# Altium schematic sheet 原理图.SchDoc
size A2
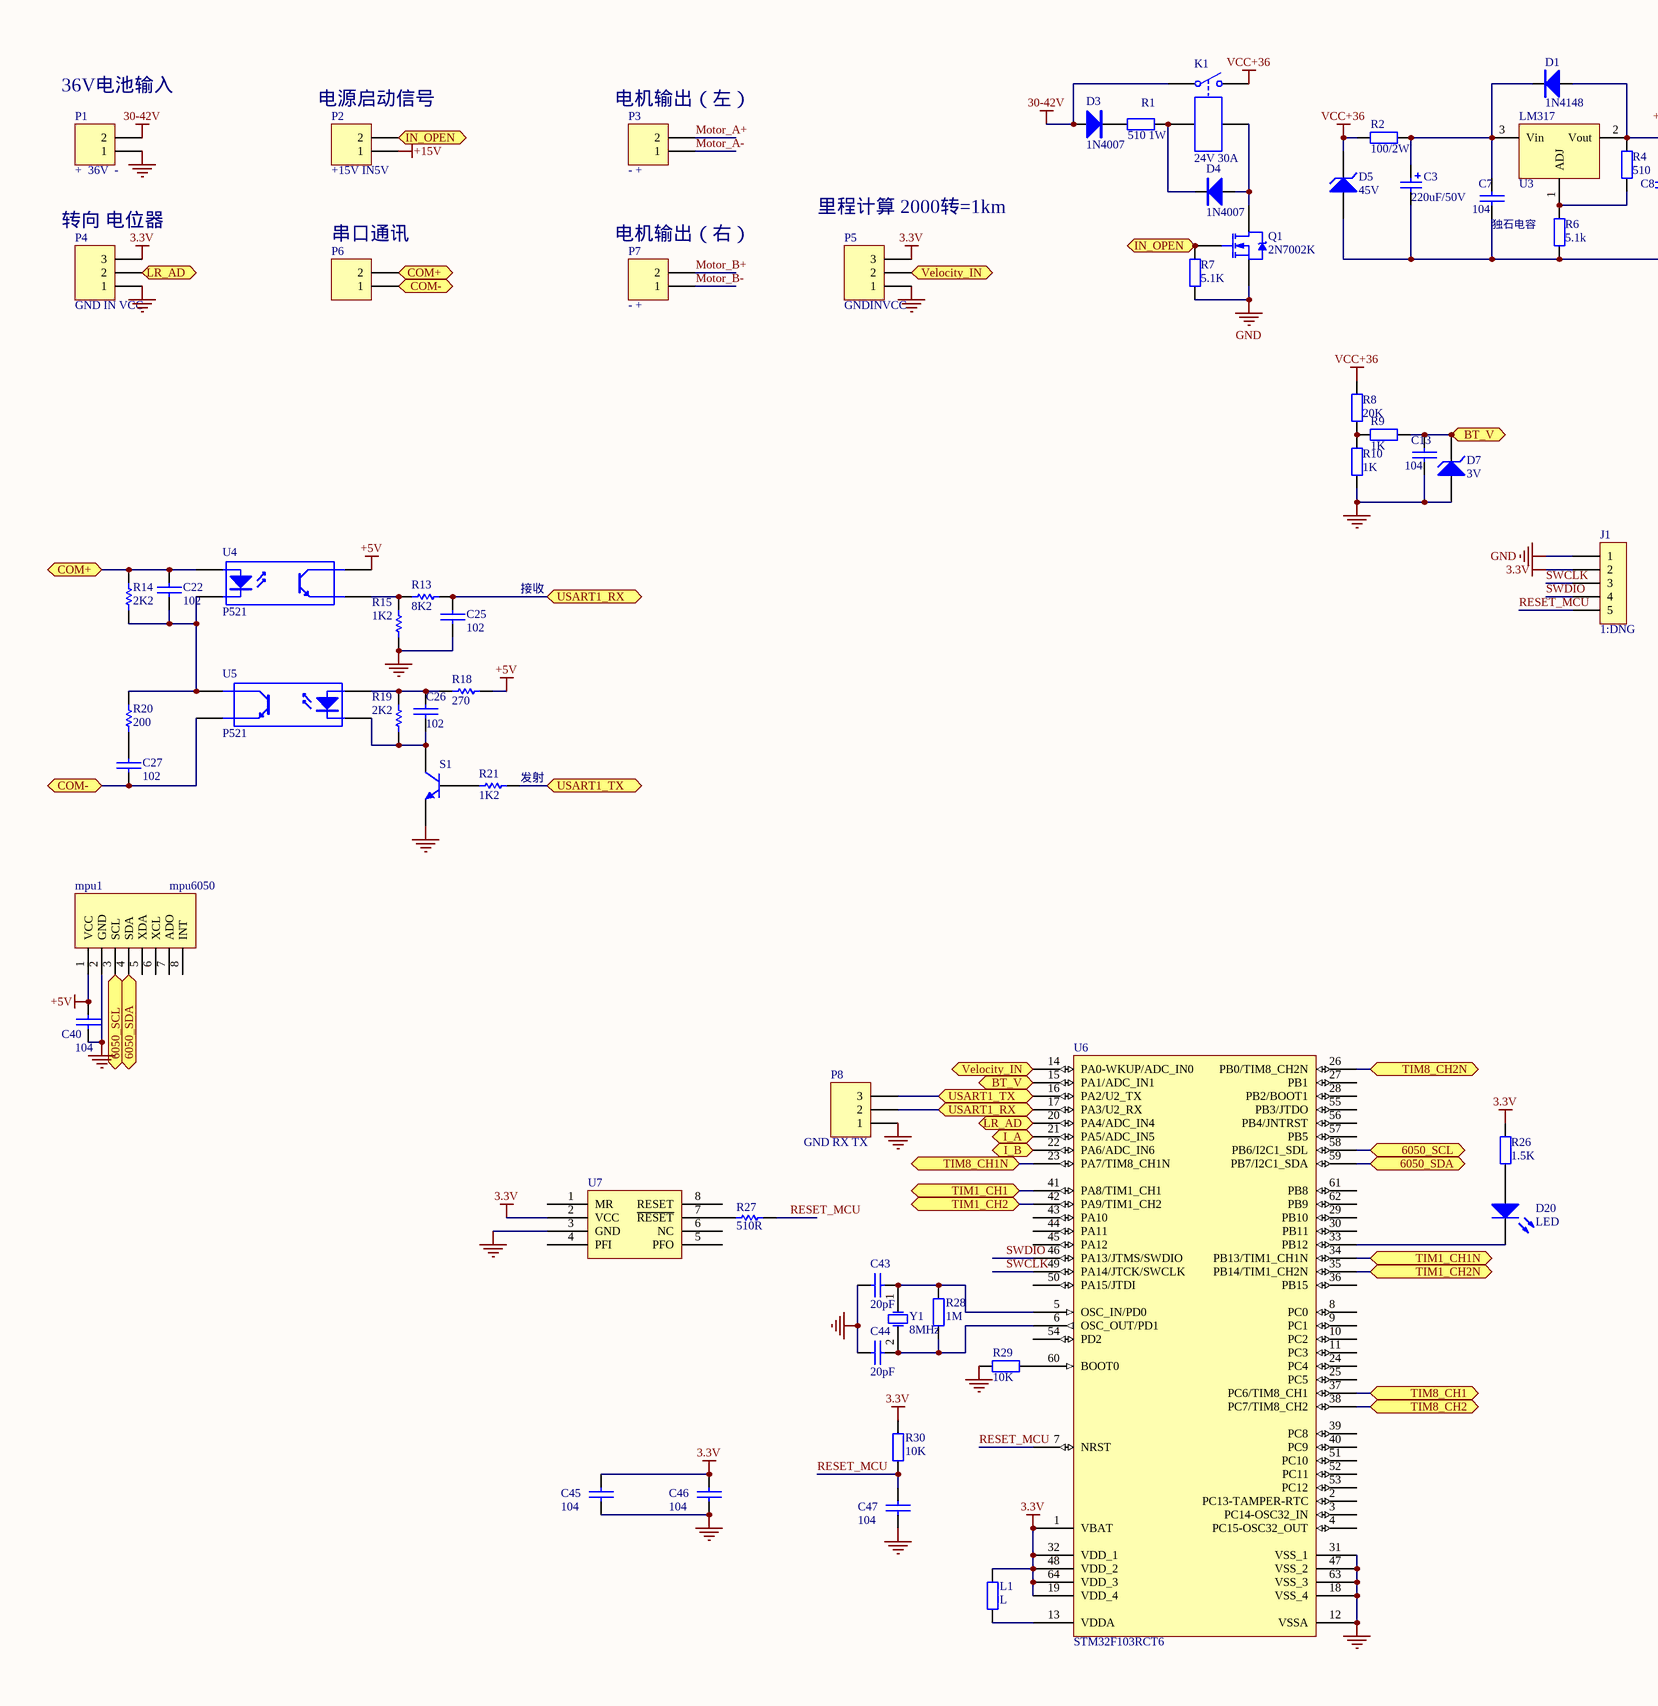
[diagram p0: 原理图.SchDoc, left]
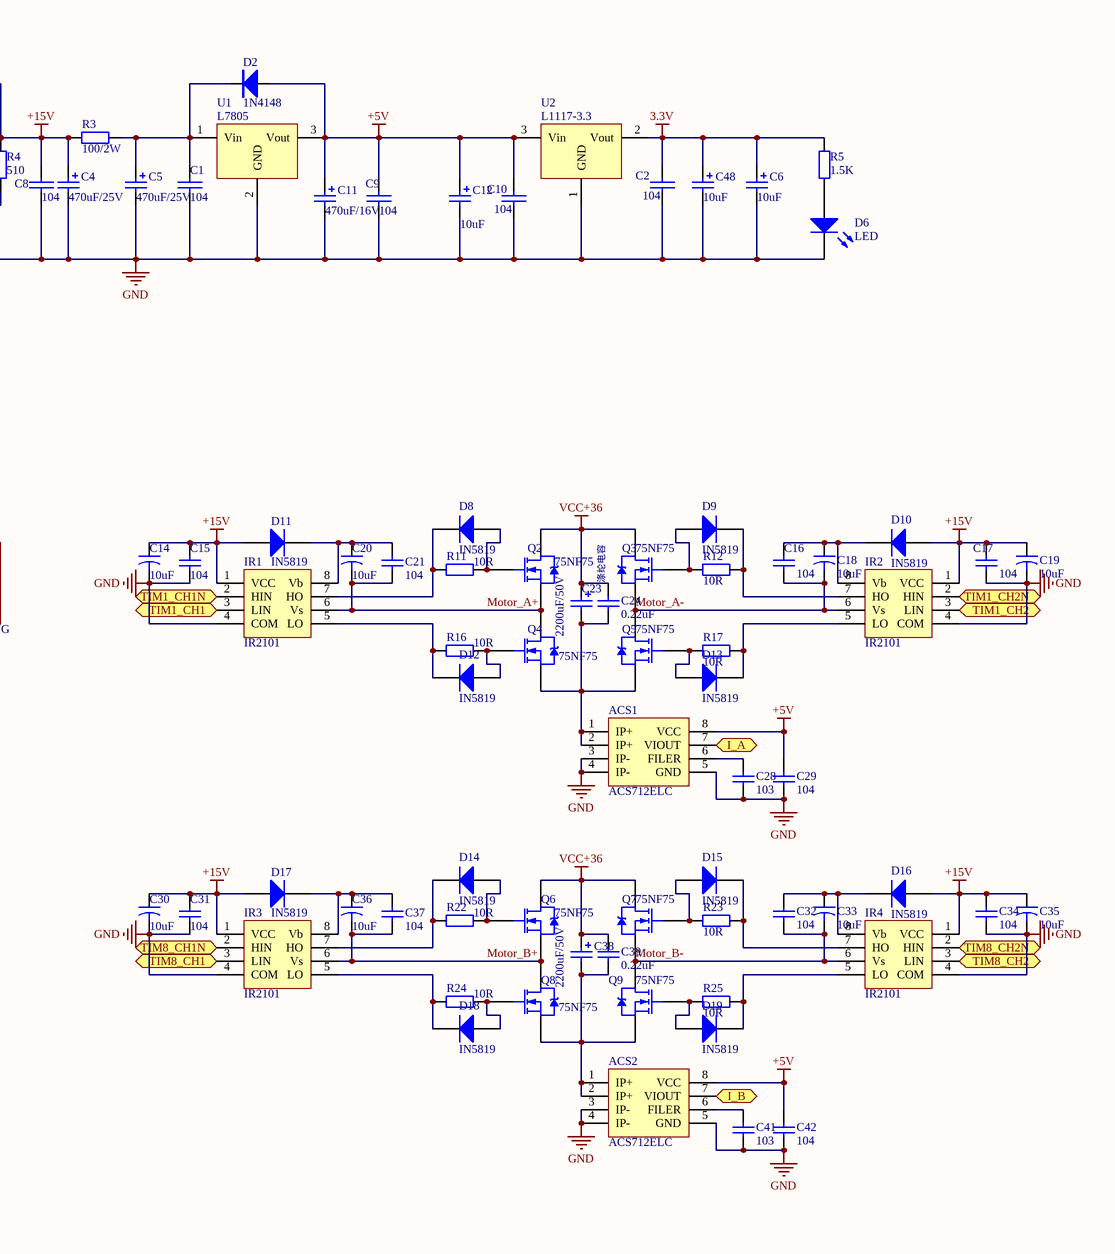
[diagram p1: 原理图.SchDoc, right]

## Parts
ACS1  ACS712ELC  [so-8]
ACS2  ACS712ELC  [so-8]
C1  104  [6-0805]
C2  104  [6-0805]
C3  220uF/50V  [SMD-EC-F10]
C4  470uF/25V  [SMD-EC-F10]
C5  470uF/25V  [SMD-EC-F10]
C6  10uF  [3216]
C7  104  [6-0805]
C8  104  [6-0805]
C9  104  [6-0805]
C10  104  [6-0805]
C11  470uF/16V  [SMD-EC-F8]
C12  10uF  [3216]
C13  104  [6-0805]
C14  10uF  [SMD-EC-F4]
C15  104  [6-0805]
C16  104  [6-0805]
C17  104  [6-0805]
C18  10uF  [SMD-EC-F4]
C19  10uF  [SMD-EC-F4]
C20  10uF  [SMD-EC-F4]
C21  104  [6-0805]
C22  102  [6-0805]
C23  2200uF/50V  [RB.3/.6]
C24  0.22uF  [RAD-0.2]
C25  102  [6-0805]
C26  102  [6-0805]
C27  102  [6-0805]
C28  103  [6-0805]
C29  104  [6-0805]
C30  10uF  [SMD-EC-F4]
C31  104  [6-0805]
C32  104  [6-0805]
C33  10uF  [SMD-EC-F4]
C34  104  [6-0805]
C35  10uF  [SMD-EC-F4]
C36  10uF  [SMD-EC-F4]
C37  104  [6-0805]
C38  2200uF/50V  [RB.3/.6]
C39  0.22uF  [RAD-0.2]
C40  104  [6-0805]
C41  103  [6-0805]
C42  104  [6-0805]
C43  20pF  [6-0805]
C44  20pF  [6-0805]
C45  104  [6-0805]
C46  104  [6-0805]
C47  104  [6-0805]
C48  10uF  [3216]
D1  1N4148  [1206D]
D2  1N4148  [1206D]
D3  1N4007  [1N4001]
D4  1N4007  [1N4001]
D5  45V  [1N5819]
D6  LED  [LEDTT]
D7  3V  [1206D]
D8  IN5819  [1N4001]
D9  IN5819  [1N4001]
D10  IN5819  [1N4001]
D11  IN5819  [1N4001]
D12  IN5819  [1N4001]
D13  IN5819  [1N4001]
D14  IN5819  [1N4001]
D15  IN5819  [1N4001]
D16  IN5819  [1N4001]
D17  IN5819  [1N4001]
D18  IN5819  [1N4001]
D19  IN5819  [1N4001]
D20  LED  [LEDTT]
IR1  IR2101  [so-8]
IR2  IR2101  [so-8]
IR3  IR2101  [so-8]
IR4  IR2101  [so-8]
J1  1:DNG  [HDR1X5H]
K1  24V 30A  [SLA]
L1  L  [0805]
mpu1  mpu6050  [MPU6050]
P1  +  36V  -  [KF1000-2P]
P2  +15V IN5V  [MKDS15_2RMI]
P3  - +  [KF1000-2P]
P4  GND IN VCC  [MKDS15_3RMI]
P5  GNDINVCC  [MKDS15_3RMI]
P6  com+ com-  [MKDS15_2RMI]  (value not drawn)
P7  - +  [KF1000-2P]
P8  GND RX TX  [HDR1X3H]
Q1  2N7002K  [SOT-23]
Q2  75NF75  [COMS-220S]
Q3  75NF75  [COMS-220S]
Q4  75NF75  [COMS-220S]
Q5  75NF75  [COMS-220S]
Q6  75NF75  [COMS-220S]
Q7  75NF75  [COMS-220S]
Q8  75NF75  [COMS-220S]
Q9  75NF75  [COMS-220S]
R1  510 1W  [r]
R2  100/2W  [R]
R3  100/2W  [R]
R4  510  [0805]
R5  1.5K  [0805]
R6  5.1k  [0805]
R7  5.1K  [0805]
R8  20K  [0805]
R9  1K  [0805]
R10  1K  [0805]
R11  10R  [0805]
R12  10R  [0805]
R13  8K2  [0805]
R14  2K2  [0805]
R15  1K2  [0805]
R16  10R  [0805]
R17  10R  [0805]
R18  270  [0805]
R19  2K2  [0805]
R20  200  [0805]
R21  1K2  [0805]
R22  10R  [0805]
R23  10R  [0805]
R24  10R  [0805]
R25  10R  [0805]
R26  1.5K  [0805]
R27  510R  [0805]
R28  1M  [0805]
R29  10K  [0805]
R30  10K  [0805]
S1  8050  [SOT23A]  (value not drawn)
U1  L7805  [D2PAK]
U2  L1117-3.3  [SOT223]
U3  LM317  [D2PAK]
U4  P521  [SO-4]
U5  P521  [SO-4]
U6  STM32F103RCT6  [LQFP64_N]
U7  MAX708-3.3  [SMD8A]  (value not drawn)
Y1  8MHz  [XTAL]

## Ports
6050_SCL, 6050_SDA, BT_V, COM+, COM-, I_A, I_B, IN_OPEN, LR_AD, TIM1_CH1, TIM1_CH1N, TIM1_CH2, TIM1_CH2N, TIM8_CH1, TIM8_CH1N, TIM8_CH2, TIM8_CH2N, USART1_RX, USART1_TX, Velocity_IN

## Nets
3.3V: C2.1 C6.1 C45.2 C46.2 C48.1 J1.2 L1.2 P4.3 P5.3 R5.2 R26.2 R30.2 U2.2(Vout) U6.1(VBAT) U6.19(VDD_4) U6.32(VDD_1) U6.48(VDD_2) U6.64(VDD_3) U7.2(VCC)
30-42V: D3.1 K1.1 P1.2
+5V: ACS1.8(VCC) ACS2.8(VCC) C9.1 C10.1 C11.1 C12.1 C29.2 C40.1 C42.2 D2.1 mpu1.1(VCC) R18.1 U1.3(Vout) U2.3(Vin) U4.4(C)
+15V: C4.1 C8.1 C14.1 C15.1 C17.1 C19.1 C30.1 C31.1 C34.1 C35.1 D1.1 D10.1(A) D11.1(A) D16.1(A) D17.1(A) IR1.1(VCC) IR2.1(VCC) IR3.1(VCC) IR4.1(VCC) P2.1 R3.1 R4.1 U3.2(Vout)
GND: ACS1.3(IP-) ACS1.4(IP-) ACS1.5(GND) ACS2.3(IP-) ACS2.4(IP-) ACS2.5(GND) C1.2 C2.2 C3.2 C4.2 C5.2 C6.2 C7.2 C8.2 C9.2 C10.2 C11.2 C12.2 C13.2 C14.2 C15.2 C17.2 C19.2 C25.1 C28.1 C29.1 C30.2 C31.2 C34.2 C35.2 C40.2 C41.1 C42.1 C43.2 C44.2 C45.1 C46.1 C47.1 C48.2 D5.1(A) D6.2(K) D7.1(A) IR1.4(COM) IR2.4(COM) IR3.4(COM) IR4.4(COM) J1.1 mpu1.2(GND) P1.1 P4.1 P5.1 P8.1 Q1.2(S) R6.2 R7.2 R10.2 R15.2 R29.2 S1.2(E) U1.2(GND) U2.1(GND) U6.12(VSSA) U6.18(VSS_4) U6.31(VSS_1) U6.47(VSS_2) U6.63(VSS_3) U7.3(GND)
VCC+36: C23.1 C24.1 C38.1 C39.1 D5.2(K) K1.2 Q2.2(D) Q3.2(D) Q6.2(D) Q7.2(D) R2.2 R8.1
6050_SCL: mpu1.3(SCL) U6.58(PB6/I2C1_SDL) ; port 6050_SCL
6050_SDA: mpu1.4(SDA) U6.59(PB7/I2C1_SDA) ; port 6050_SDA
BT_V: C13.1 D7.2(K) R9.2 U6.15(PA1/ADC_IN1) ; port BT_V
COM+: C22.2 P6.2 R14.2 U4.1(A) ; port COM+
COM-: C27.1 P6.1 U5.3(E) ; port COM-
I_A: ACS1.7(VIOUT) U6.21(PA5/ADC_IN5) ; port I_A
I_B: ACS2.7(VIOUT) U6.22(PA6/ADC_IN6) ; port I_B
IN_OPEN: P2.2 Q1.1(G) R7.1 ; port IN_OPEN
LR_AD: P4.2 U6.20(PA4/ADC_IN4) ; port LR_AD
Motor_A+: C20.2 C21.2 IR1.6(Vs) P3.2 Q2.3(S) Q4.2(D)
Motor_A-: C16.2 C18.2 IR2.6(Vs) P3.1 Q3.3(S) Q5.2(D)
Motor_B+: C36.2 C37.2 IR3.6(Vs) P7.2 Q6.3(S) Q8.2(D)
Motor_B-: C32.2 C33.2 IR4.6(Vs) P7.1 Q7.3(S) Q9.2(D)
RESET_MCU: C47.2 J1.5 R27.1 R30.1 U6.7(NRST)
SWCLK: J1.3 U6.49(PA14/JTCK/SWCLK)
SWDIO: J1.4 U6.46(PA13/JTMS/SWDIO)
TIM1_CH1: IR1.3(LIN) U6.41(PA8/TIM1_CH1) ; port TIM1_CH1
TIM1_CH1N: IR1.2(HIN) U6.34(PB13/TIM1_CH1N) ; port TIM1_CH1N
TIM1_CH2: IR2.3(LIN) U6.42(PA9/TIM1_CH2) ; port TIM1_CH2
TIM1_CH2N: IR2.2(HIN) U6.35(PB14/TIM1_CH2N) ; port TIM1_CH2N
TIM8_CH1: IR3.3(LIN) U6.37(PC6/TIM8_CH1) ; port TIM8_CH1
TIM8_CH1N: IR3.2(HIN) U6.23(PA7/TIM8_CH1N) ; port TIM8_CH1N
TIM8_CH2: IR4.3(LIN) U6.38(PC7/TIM8_CH2) ; port TIM8_CH2
TIM8_CH2N: IR4.2(HIN) U6.26(PB0/TIM8_CH2N) ; port TIM8_CH2N
USART1_RX: C25.2 P8.2 R13.2 U6.17(PA3/U2_RX) ; port USART1_RX
USART1_TX: P8.3 R21.2 U6.16(PA2/U2_TX) ; port USART1_TX
Velocity_IN: P5.2 U6.14(PA0-WKUP/ADC_IN0) ; port Velocity_IN
NetACS1_1: ACS1.1(IP+) ACS1.2(IP+) C23.2 C24.2 Q4.3(S) Q5.3(S)
NetACS1_6: ACS1.6(FILER) C28.2
NetACS2_1: ACS2.1(IP+) ACS2.2(IP+) C38.2 C39.2 Q8.3(S) Q9.3(S)
NetACS2_6: ACS2.6(FILER) C41.2
NetC1_1: C1.1 C5.1 D2.2 R3.2 U1.1(Vin)
NetC3_1: C3.1 C7.1 D1.2 R2.1 U3.3(Vin)
NetC16_1: C16.1 C18.1 D10.2(K) IR2.8(Vb)
NetC20_1: C20.1 C21.1 D11.2(K) IR1.8(Vb)
NetC22_1: C22.1 R14.1 R20.2 U4.2(K) U5.4(C)
NetC26_1: C26.1 R19.2 S1.3(C) U5.2(K)
NetC26_2: C26.2 R18.2 R19.1 U5.1(A)
NetC27_2: C27.2 R20.1
NetC32_1: C32.1 C33.1 D16.2(K) IR4.8(Vb)
NetC36_1: C36.1 C37.1 D17.2(K) IR3.8(Vb)
NetC43_1: C43.1 R28.1 U6.5(OSC_IN/PD0) Y1.1(OSC1)
NetC44_1: C44.1 R28.2 U6.6(OSC_OUT/PD1) Y1.2(OSC2)
NetD3_2: D3.2 R1.1
NetD4_1: D4.1 K1.3 Q1.3(D)
NetD4_2: D4.2 K1.4 R1.2
NetD6_1: D6.1(A) R5.1
NetD8_1: D8.1(A) Q2.1(G) R11.2
NetD8_2: D8.2(K) IR1.7(HO) R11.1
NetD9_1: D9.1(A) Q3.1(G) R12.2
NetD9_2: D9.2(K) IR2.7(HO) R12.1
NetD12_1: D12.1(A) Q4.1(G) R16.2
NetD12_2: D12.2(K) IR1.5(LO) R16.1
NetD13_1: D13.1(A) Q5.1(G) R17.2
NetD13_2: D13.2(K) IR2.5(LO) R17.1
NetD14_1: D14.1(A) Q6.1(G) R22.2
NetD14_2: D14.2(K) IR3.7(HO) R22.1
NetD15_1: D15.1(A) Q7.1(G) R23.2
NetD15_2: D15.2(K) IR4.7(HO) R23.1
NetD18_1: D18.1(A) Q8.1(G) R24.2
NetD18_2: D18.2(K) IR3.5(LO) R24.1
NetD19_1: D19.1(A) Q9.1(G) R25.2
NetD19_2: D19.2(K) IR4.5(LO) R25.1
NetD20_1: D20.1(A) R26.1
NetD20_2: D20.2(K) U6.33(PB12)
NetL1_1: L1.1 U6.13(VDDA)
NetR4_2: R4.2 R6.1 U3.1(ADJ)
NetR8_2: R8.2 R9.1 R10.1
NetR13_1: R13.1 R15.1 U4.3(E)
NetR21_1: R21.1 S1.1(B)
NetR27_2: R27.2 U7.7(~{RESET})
NetR29_1: R29.1 U6.60(BOOT0)

Not connected (* = marked no-connect by the designer): mpu1 5(XDA) 6(XCL) 7(ADO) 8(INT); U6 2(PC13-TAMPER-RTC) 3(PC14-OSC32_IN) 4(PC15-OSC32_OUT) 8(PC0) 9(PC1) 10(PC2) 11(PC3) 24(PC4) 25(PC5) 27(PB1) 28(PB2/BOOT1) 29(PB10) 30(PB11) 36(PB15) 39(PC8) 40(PC9) 43(PA10) 44(PA11) 45(PA12) 50(PA15/JTDI) 51(PC10) 52(PC11) 53(PC12) 54(PD2) 55(PB3/JTDO) 56(PB4/JNTRST) 57(PB5) 61(PB8) 62(PB9); U7 1(MR) 4(PFI) 5(PFO) 6(NC) 8(RESET)

## Notes on the sheet
- (near P1) 36V电池输入
- (near P2) 电源启动信号
- (near P3) 电机输出（左）
- (near P4) 转向 电位器
- (near P6) 串口通讯
- (near P7) 电机输出（右）
- (near P5) 里程计算 2000转=1km
- (near C7) 独石电容
- 接收
- 涤纶电容
- (near R21) 发射

## Library data of the parts
C1 C2 C7-C10 C13 C22 C25-C27 C40 = CAP: Capacitor
C3-C6 C11 C12 C23 C38 C48 = Cap Pol2: Polarized Capacitor (Axial); Value: 100pF; Published: 8-Jun-2000; LatestRevisionDate: 17-Jul-2002; LatestRevisionNote: Re-released for DXP Platform.; PackageReference: POLAR0.8; Publisher: Altium Limited
C14 C18-C20 C30 C33 C35 C36 = Cap2: Capacitor; Value: 4.7uF; Published: 23-Sep-2002; Publisher: Altium Limited
C15-C17 C21 C24 C28 C29 C31 C32 C34 C37 C39 C41 C42 = Cap: Capacitor; Value: 100nF; Published: 8-Jun-2000; Revision: July-2002: Re-released for DXP Platform.; Publisher: Altium Limited
C43-C47 = C-0805
D1-D4 = DIODE
D5 D7 = D Zener: Zener Diode; Published: 8-Jun-2000; LatestRevisionDate: 17-Jul-2002; LatestRevisionNote: Re-released for DXP Platform.; PackageReference: DIODE-0.7; Publisher: Altium Limited
D6 D20 = LED0: Typical INFRARED GaAs LED; Published: 29.4; LatestRevisionDate: 08-Jul-2005; LatestRevisionNote: Mech Layer 1 removed.; PackageReference: LED-0; Publisher: Altium Limited
D8-D19 = Diode 1N4007: 1 Amp General Purpose Rectifier; Revision 1: 11-Jul-2000: SIM Model Added.; Revision 2: 17-Jul-2002: Re-released for DXP Platform.; Package Information: Latest Revision: Aug-1999; Code - JEDEC: DO-204-AL; Published: 8-Jun-2000; Datasheet: Latest Revision: 1998; Package Reference: DO-41; Publisher: Altium Limited
IR1-IR4 = IR2012
J1 = CON5
K1 = Relay-SPST: Single-Pole Single-Throw Relay; Published: 24-Mar-1999; LatestRevisionDate: 17-Jul-2002; LatestRevisionNote: Re-released for DXP Platform.; PackageReference: MODULE4; Publisher: Altium Limited
L1 R28 R30 = RES2-0805
P1-P3 P6 P7 = Header 2: Header, 2-Pin; LatestRevisionDate: 17-Jul-2002; LatestRevisionNote: Re-released for DXP Platform.; Publisher: Altium Limited
P4 P5 P8 = Header 3: Header, 3-Pin; LatestRevisionDate: 17-Jul-2002; LatestRevisionNote: Re-released for DXP Platform.; Publisher: Altium Limited
Q1 = NMOS-2: N-Channel Power MOSFET; Note: Pin 2 is electrically connected to pin 4.; Published: 8-Jun-2000; LatestRevisionDate: 17-Jul-2002; LatestRevisionNote: Re-released for DXP Platform.; DatasheetDocument: PD-9.814; PackageReference: TO-220AB; Publisher: Altium Limited; Code_JEDEC: TO-220-AB; ComponentLink1Description: Manufacturer Link; ComponentLink1URL: http://www.irf.com/
Q2-Q9 = IRF1405: HEXFET Power MOSFET; Package Information: Latest Revision: Feb-1997; Note: Pin 2 is electrically connected to Tab (Drain).; Published: 17-Sep-2003; Datasheet: Latest Revision: 25-Mar-2001; Package Reference: TO-220AB; Publisher: Altium Limited
R1-R6 R26 = Res2: Resistor; Value: 1K; Published: 8-Jun-2000; LatestRevisionDate: 17-Jul-2002; LatestRevisionNote: Re-released for DXP Platform.; PackageReference: AXIAL-0.4; Publisher: Altium Limited
R7-R12 R16 R17 R22-R25 R29 = Res Semi: Semiconductor Resistor; Value: 47R; Published: 8-Jun-2000; Revision: July-2002: Re-released for DXP Platform.; Publisher: Altium Limited
R13-R15 R18-R21 = res1: Resistor; Published: *; Revision: *; Publisher: *; Value: *
R27 = Res1: Resistor; Published: *; Revision: *; Publisher: *; Value: *
S1 = 2N3904: NPN General Purpose Amplifier; Published: 8-Jun-2000; LatestRevisionDate: 15-Jan-2003; LatestRevisionNote: PCB Footprint 'BCY-W3/D4.7' replaced; DatasheetDocument: 1997; PackageReference: TO-92A; Publisher: Altium Limited; Code_JEDEC: TO-92A
U1 U2 = LM78XX
U4 U5 = OPTOISO1: Optoisolator
U6 = STM32F103RBT6: STM32 ARM-based 32-bit MCU with 128 Kbytes Flash, 64-pin LQFP, Industrial Temperature; Published: 30-May-2008; DatasheetVersion: rev6, Mar-2008; PackageVersion: Mar-2008; PackageReference: LQFP64; Publisher: Altium Limited; PackageDescription: 64-Pin Low-Profile Quad Flat Pack, 10 x 10 mm Body, 0.5 mm Pitch (LQFP64); ComponentLink1Description: Manufacturer Link; ComponentLink1URL: www.st.com/stm32; ComponentLink2Description: Datasheet; ComponentLink2URL: http://www.st.com/stonline/products/literature/ds/13587.pdf
U7 = MAX708
Y1 = XTAL